# Altium schematic sheet 3V3_REG.SchDoc
size A4; SheetNumber: 4; SheetTotal: 6
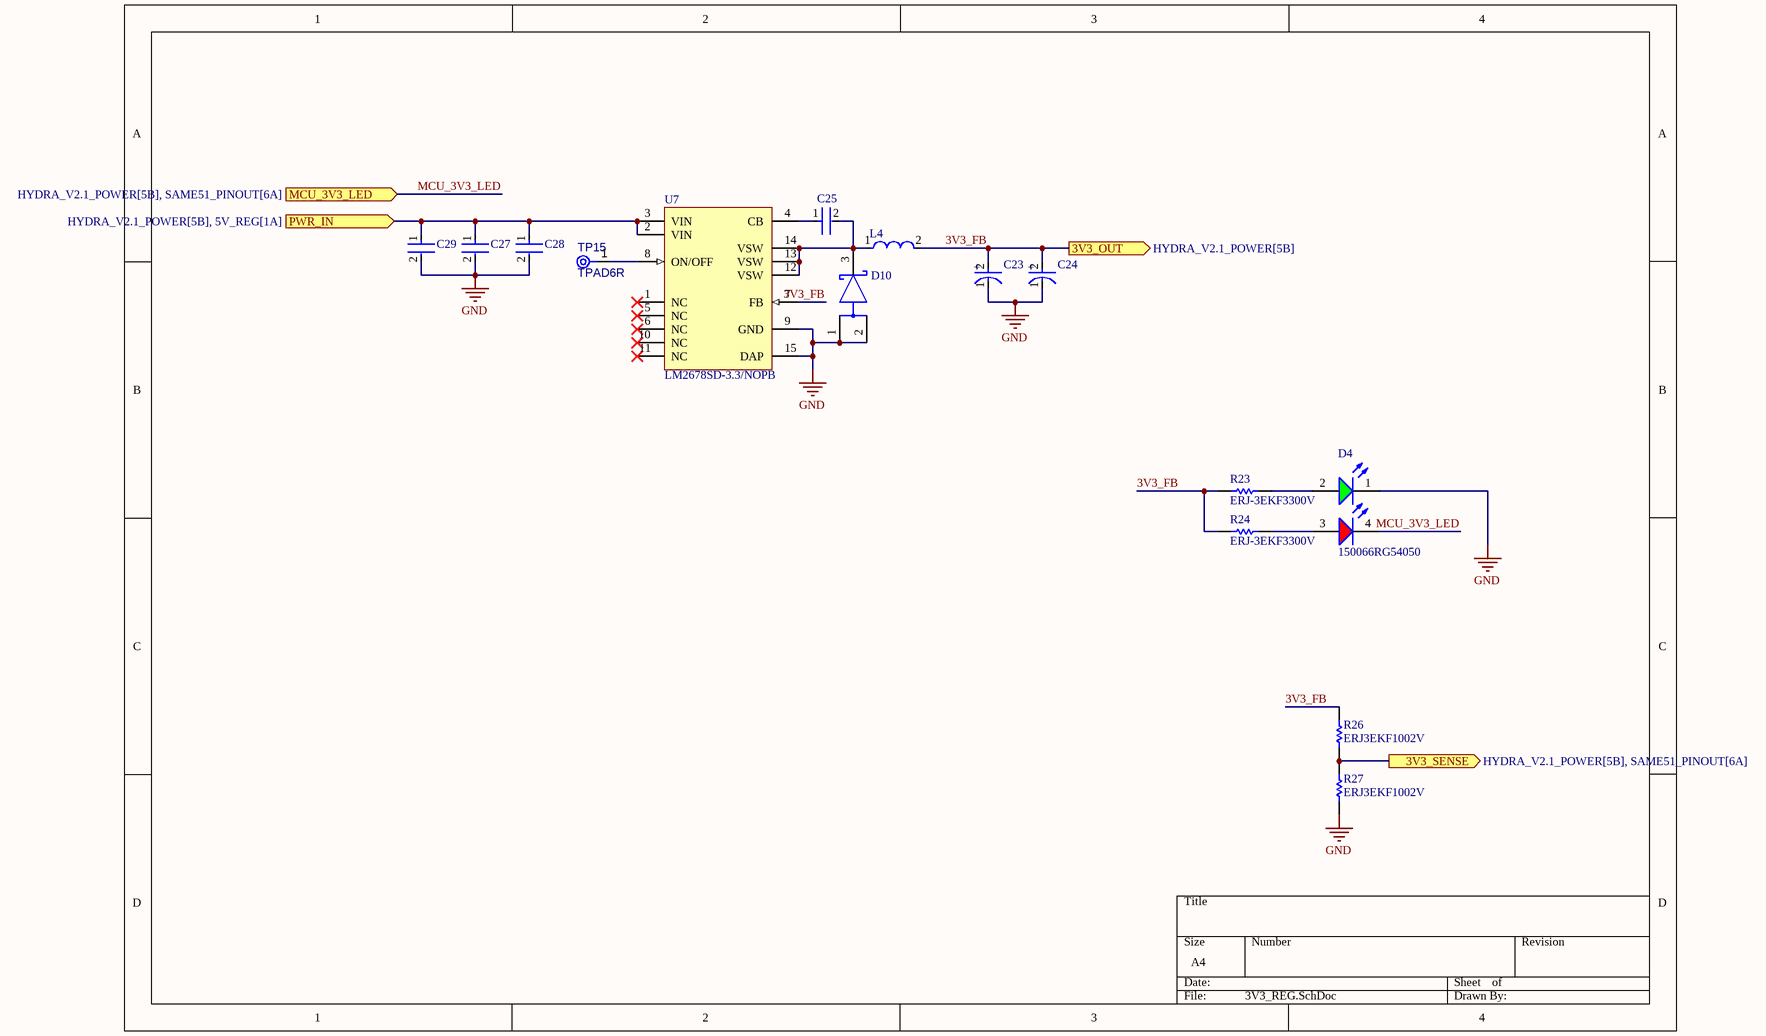
[diagram p0: 3V3_REG.SchDoc]

## Parts
C23  10TPC68M  [FP-POSCAP-D2-MFG]  (value not drawn)
C24  10TPC68M  [FP-POSCAP-D2-MFG]  (value not drawn)
C25  C0805C103J5RACTU  [FP-C0805C-DN-MFG]  (value not drawn)
C27  C2012X5R1V156M125AC  [FP-C2012-125-0_2-MFG]  (value not drawn)
C28  C2012X5R1V156M125AC  [FP-C2012-125-0_2-MFG]  (value not drawn)
C29  C2012X5R1V156M125AC  [FP-C2012-125-0_2-MFG]  (value not drawn)
D4  150066RG54050  [WL-SBCD_0606]
D10  SS5P10-M3/86A  [FP-95570-MFG]  (value not drawn)
L4  IHLP4040DZER220M11  [FP-IHLP-4040DZ-FP_3_124x3-MFG]  (value not drawn)
R23  ERJ-3EKF3300V  [RESC1608X55X30LL15T15]
R24  ERJ-3EKF3300V  [RESC1608X55X30LL15T15]
R26  ERJ3EKF1002V  [RESC1609X55X30LL15T15]
R27  ERJ3EKF1002V  [RESC1609X55X30LL15T15]
TP15  TPAD6R  [TP06R]  (no BOM)
U7  LM2678SD-3.3/NOPB  [NHM0014A_V]

## Ports
3V3_OUT (out, see HYDRA_V2.1_POWER[5B]), 3V3_SENSE (out, see HYDRA_V2.1_POWER[5B], SAME51_PINOUT[6A]), MCU_3V3_LED (in, see HYDRA_V2.1_POWER[5B], SAME51_PINOUT[6A]), PWR_IN (in, see HYDRA_V2.1_POWER[5B], 5V_REG[1A])

## Nets
GND: C23.1(C) C24.1(C) C27.2 C28.2 C29.2 D4.1(K) D10.1(A) D10.2(A) R27.1 U7.9(GND) U7.15(DAP)
3V3_FB: C23.2(A) C24.2(A) L4.2 R23.1 R24.1 R26.2 U7.7(FB) ; port 3V3_OUT
3V3_SENSE: R26.1 R27.2 ; port 3V3_SENSE
MCU_3V3_LED: D4.4(K) ; port MCU_3V3_LED
PWR_IN: C27.1 C28.1 C29.1 U7.2(VIN) U7.3(VIN) ; port PWR_IN
NetC25_1: C25.1 U7.4(CB)
NetC25_2: C25.2 D10.3(C) L4.1 U7.12(VSW) U7.13(VSW) U7.14(VSW)
NetD4_2: D4.2(A) R23.2
NetD4_3: D4.3(A) R24.2
NetTP15_1: TP15.1(TP) U7.8(ON/OFF)

Not connected (* = marked no-connect by the designer): U7 1(NC)* 5(NC)* 6(NC)* 10(NC)* 11(NC)*

## Notes on the sheet
- (in symbol CMP-05428-000598-1) +

## Library data of the parts
C23 C24 = CMP-05428-000598-1: Molded Tantalum Polymer Capacitor 68uF 20% 10V life 2000Hours SMD 2917; Dissipation Factor: 10%; ESR (Equivalent Series Resistance): 45mR; Leakage Current: 68uA; Polarity: Polar; Ripple Current: 1.7A; Material: Polymer; Voltage Rating: 10V; Voltage: 10V; Features: General Purpose; Width: 4.3mm; Packaging: Tape and Reel; Termination: SMD/SMT; Radiation Hardening: No; Construction: Flat; Height: 1.9mm; Height - Seated (Max): 0.079inch; Case Code (Metric): 7343; Length: 7.3mm; Case/Package: 2917; Depth: 4.3mm; Mount: Surface Mount; Capacitance: 68uF; Case Code (Imperial): 2917; Package Quantity: 3000; Tolerance: 20%; REACH SVHC: No SVHC; Series: POSCAP™ TPC; Lead Free: Lead Free; Min Operating Temperature: -55°C; RoHS Compliant: Yes; Voltage Rating (DC): 10V; Number of Pins: 2; Max Operating Temperature: 105°C
C25 = CMP-2007-00254-2: CAP CER 10000PF 50V X7R 0805; Manufacturer: KEMET; Value: 10,000 pF; Material: Ceramic; Temperature Coefficient: 30ppm/°C; Tolerance: 0.05; Device Class L1: Passive Components; Temperature: -55°C to +125°C; Lead Free: Yes; ComponentLink2URL: https://content.kemet.com/datasheets/KEM_C1003_C0G_SMD.pdf; Device Class L3: Ceramic Capacitors; Temperature Characteristic: X7R; Temperature Range High: +125°C; Mouser Description: Capacitor; Ceramic; Cap 0.01uF; Tol 5%; Vol-Rtg 50 V; SMT; Case 0805; X7R; TR; ComponentLink2Description: Datasheet; Manufacturer Part Number: C0805C103J5RACTU; Height: 0.88mm; Digikey Description: CAP CER 10000PF 50V X7R 0805; Capacitance: 10,000 pF; Temperature Range Low: -55°C; Device Class L2: Capacitors; Octopart: https://octopart.com/c0805c103j5ractu-kemet-133473; Voltage Rating: 50 V; Category: Cap; RoHS: TRUE; Automotive: No; Package: C0805C-DN; Ipc Land Pattern Name: CAPC200125X78
C27-C29 = CMP-08246-005496-1: Multilayer Ceramic Capacitors 15μF ±20% 35V X5R SMD 0805; Capacitance: 15uF; Mount: Surface Mount; Dielectric Material: Ceramic; Package Quantity: 2000; Termination: SMD/SMT; Height: 1.25mm; Min Operating Temperature: -55°C; Tolerance: 20%; Width: 0.049inch; Length: 0.079inch; Lead Free: Lead Free; Max Operating Temperature: 85°C; Voltage Rating: 35V; Case/Package: 0805; Packaging: Tape and Reel; RoHS Compliant: Yes; Case Code (Metric): 2012; Voltage Rating (DC): 35V; Dielectric: X5R; Thickness: 0.057inch; Case Code (Imperial): 0805; Resistor Type: Ceramic; Series: C
D4 = CMP-004-00034-2: Led, Red/Grn, 180Mcd/230Mcd, 624Nm/525Nm Rohs Compliant: Yes
D10 = CMP-02539-000057-1: DIODE SCHOTTKY 100V 5A TO277A; Max Forward Surge Current (Ifsm): 150A; Element Configuration: Common Cathode; Max Reverse Leakage Current: 15uA; Forward Voltage: 880mV; Case/Package: TO-277A; Number of Pins: 3; Max Reverse Voltage (DC): 100V; Height: 0.031inch; Peak Non-Repetitive Surge Current: 150A; Series: eSMP®; Radiation Hardening: No; Length: 0.242inch; Max Repetitive Reverse Voltage (Vrrm): 100V; Forward Current: 5A; Width: 0.171inch; Min Operating Temperature: -55°C; Max Surge Current: 150A; Lead Free: Lead Free; RoHS Compliant: Yes; Average Rectified Current: 5A; Max Operating Temperature: 150°C; Max Reverse Current: 15uA; Package Quantity: 1500; Packaging: Tape and Reel; Mount: Surface Mount
L4 = CMP-02424-000785-1: Commercial Inductors, Low DCR Series 22uH 5A 66mΩ 20%; Shielding: Shielded; Max DC Current: 4.5A; Test Frequency: 100kHz; DC Resistance (DCR): 66mR; Self Resonant Frequency: 1MHz; Core Material: Metal; Series: IHLP-4040DZ-11; Min Operating Temperature: -55°C; Rated Current-Max: 5A; Current Rating: 5A; Military Standard: Not; Depth: 10.3mm; Height - Seated (Max): 0.157inch; Contact Plating: Tin; Termination: SMD/SMT; Length: 0.43inch; Package Quantity: 1; Width: 0.405inch; Inductance Tolerance: 20%; Tolerance: 20%; Height: 4mm; RMS Current (Irms): 5A; Saturation Current: 4.5A; Inductance: 22uH; Mount: Surface Mount; Max Operating Temperature: 125°C; Case/Package: 4040; Packaging: Tape and Reel; Radiation Hardening: No; RoHS Compliant: Yes; Lead Free: Lead Free
R23 R24 = CMP-2000-00435-2: Chip Resistor, 330 Ohm, +/- 1%, 0.1 W, -55 to 155 degC, 0603 (1608 Metric), RoHS, Tape and Reel; Gender: Male; Mating Cycles: 10000; Current Rating: 500 mA; Voltage Rating: 10 V; REACH SVHC: No SVHC; PackageDescription: 2-Pin Surface Mount Device, Body 1.6 x 0.85 mm; Contact Finish: Gold; Pins: 8; ComponentLink1Description: Manufacturer URL; Packaging: Tape and Reel; Max Operating Temperature: 85 degC; Contact Material: Copper; Height: 1.45 mm; Width: 1.45 mm; DatasheetVersion: Apr-15; Package Quantity: 1500; Contact Plating: Gold; PackageReference: 0603; Mount: Surface Mount; Lead Pitch: 1.1 mm; Min Operating Temperature: -25 degC; ComponentLink1URL: http://www.panasonic.com/; ComponentLink2URL: http://industrial.panasonic.com/cdbs/www-data/pdf/RDA0000/AOA0000C86.pdf; Length: 13.7 mm; ComponentLink2Description: Datasheet; RoHSCompliant: true
R26 R27 = CMP-1012-00623-3: Chip Resistor, 10 KOhm, +/- 1%, 0.1 W, -55 to 155 degC, 0603 (1608 Metric), RoHS, Tape and Reel; Manufacturer: Panasonic; Voltage Rating: 75V; Case\/Package: 0603; Power Rating: 100mW; Resistance: 10KOhm; Temperature Coefficient: 100ppm\/degreesC; Number of Pins: 2; Package Reference: 603; Depth: 0.8mm; Mount: SurfaceMount; Package Description: 2-Pin Surface Mount Device, Body 1.6 x 0.85 mm; Datasheet Version: 02/2017; Length: 1.6mm; Lead Free: LeadFree; Height: 0.45mm; Number of Terminations: 2; Max Power Dissipation: 100mW; Min Operating Temperature: -55degC; Datasheet URL: https://industrial.panasonic.com/cdbs/www-data/pdf/RDA0000/AOA0000C304.pdf; Termination: SMD/SMT; Case Code (Metric): 1608; Case Code (Imperial): 0603; Tolerance: 1%; Max Operating Temperature: 155degC; RoHSCompliant: true; Voltage Rating (DC): 75V; Radiation Hardening: No; Packaging: TapeandReel; Composition: ThickFilm; Mounting Technology: SurfaceMount; Manufacturer URL: http://www.panasonic.com/; Width: 0.031inch; REACH SVHC: NoSVHC; Contact Plating: Tin; Military Standard: Not; Package Quantity: 1
TP15 = CMP-00028-00002-2: 0.6mm round; Pins: 1
U7 = CMP-0069-01078-3: SIMPLE SWITCHER® High Efficiency 5A Step-Down Voltage Regulator, 14-pin LLP, Pb-Free; Manufacturer: Texas Instruments; PackageTopMarking: NS*UZXYTT*S0003CB; PowerWise: N; CompType: Switcher; PackageDescription: LLP, Plastic, Dual, 6 x 5 x 1mm Body, 14 Lead, 0.8mm Pitch, No Pullback; PackageReference: NHM0014A; PinCount: 14; ComponentLink1URL: http://www.ti.com/general/docs/lit/getliterature.tsp?genericPartNumber=LM2678&fileType=pdf; RoHS: Y; ComponentLink1Description: Datasheet URL